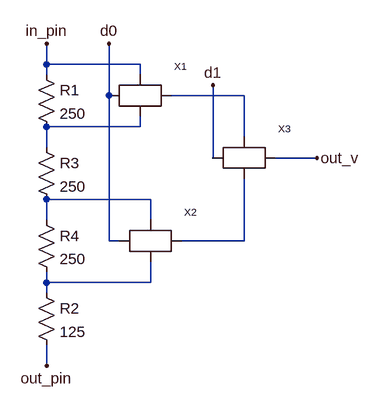
[diagram p0: schematic level1.asc]
level1.asc, the LTspice schematic file:
Version 4
SHEET 1 880 680
WIRE -32 48 -32 16
WIRE 112 48 -32 48
WIRE -32 64 -32 48
WIRE 112 64 112 48
WIRE 64 96 64 16
WIRE 272 96 160 96
WIRE 112 144 112 128
WIRE 112 144 -32 144
WIRE 272 160 272 96
WIRE -32 176 -32 144
WIRE 224 192 224 80
WIRE 384 192 320 192
WIRE 128 256 -32 256
WIRE -32 288 -32 256
WIRE 128 288 128 256
WIRE 64 320 64 96
WIRE 80 320 64 320
WIRE 272 320 272 224
WIRE 272 320 176 320
WIRE -32 384 -32 368
WIRE 128 384 128 352
WIRE 128 384 -32 384
WIRE -32 400 -32 384
WIRE -32 512 -32 480
FLAG -32 16 in_pin
FLAG -32 512 out_pin
FLAG 64 16 d0
FLAG 224 80 d1
FLAG 384 192 out_v
SYMBOL switch 112 96 R0
SYMATTR InstName X1
SYMBOL switch 128 320 R0
SYMATTR InstName X2
SYMBOL switch 272 192 R0
SYMATTR InstName X3
SYMBOL res -48 48 R0
SYMATTR InstName R1
SYMATTR Value 250
SYMBOL res -48 384 R0
SYMATTR InstName R2
SYMATTR Value 125
SYMBOL res -48 160 R0
SYMATTR InstName R3
SYMATTR Value 250
SYMBOL res -48 272 R0
SYMATTR InstName R4
SYMATTR Value 250

The netlist it stands for:
* level1.asc
XX1 d0 in_pin N002 N001 switch  ; pins dig_in in_1 in_2 Vout
XX2 d0 N003 N005 N004 switch  ; pins dig_in in_1 in_2 Vout
XX3 d1 N001 N004 out_v switch  ; pins dig_in in_1 in_2 Vout
R1 in_pin N002 250
R2 N005 out_pin 125
R3 N002 N003 250
R4 N003 N005 250
.backanno
.end